# Altium schematic sheet Sensors.SchDoc
size A
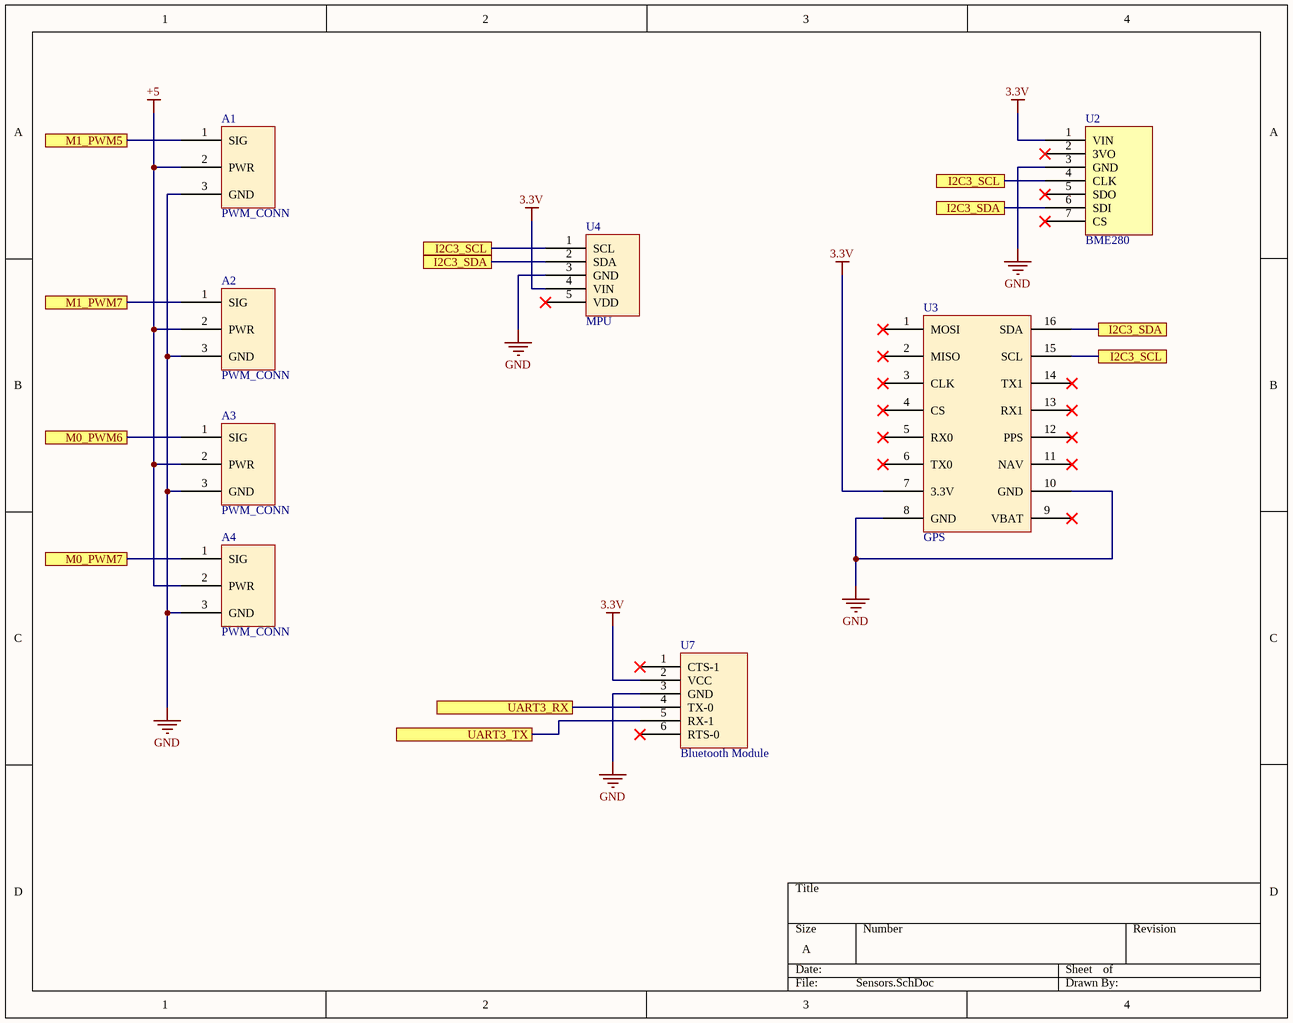
[diagram p0: Sensors.SchDoc]

## Parts
A1  PWM_CONN  [Dupont]
A2  PWM_CONN  [Dupont]
A3  PWM_CONN  [Dupont]
A4  PWM_CONN  [Dupont]
U2  BME280  [BME280]
U3  GPS  [GPS_FOOTPRINT]
U4  MPU  [MPU]
U7  Bluetooth Module  [Bluetooth]

## Ports
I2C3_SCL, I2C3_SDA, M0_PWM6, M0_PWM7, M1_PWM5, M1_PWM7, UART3_RX, UART3_TX

## Nets
3.3V: U2.1(VIN) U3.7(3.3V) U4.4(VIN) U7.2(VCC)
+5: A1.2(PWR) A2.2(PWR) A3.2(PWR) A4.2(PWR)
GND: A1.3(GND) A2.3(GND) A3.3(GND) A4.3(GND) U2.3(GND) U3.8(GND) U3.10(GND) U4.3(GND) U7.3(GND)
I2C3_SCL: U2.4(CLK) U3.15(SCL) U4.1(SCL) ; port I2C3_SCL
I2C3_SDA: U2.6(SDI) U3.16(SDA) U4.2(SDA) ; port I2C3_SDA
M0_PWM6: A3.1(SIG) ; port M0_PWM6
M0_PWM7: A4.1(SIG) ; port M0_PWM7
M1_PWM5: A1.1(SIG) ; port M1_PWM5
M1_PWM7: A2.1(SIG) ; port M1_PWM7
UART3_RX: U7.4(TX-0) ; port UART3_RX
UART3_TX: U7.5(RX-1) ; port UART3_TX

Not connected (* = marked no-connect by the designer): U2 2(3VO)* 5(SDO)* 7(CS)*; U3 1(MOSI)* 2(MISO)* 3(CLK)* 4(CS)* 5(RX0)* 6(TX0)* 9(VBAT)* 11(NAV)* 12(PPS)* 13(RX1)* 14(TX1)*; U4 5(VDD)*; U7 1(CTS-1)* 6(RTS-0)*